# Altium schematic sheet dub synth.SchDoc: Dub Siren
size A3; Date: 3/2/2018; Author: Francisco J Fernández; DrawnBy: Francisco J Fernández; Address1: C\ Cristo de la Yedra nº 18, 3; Address4: 18012 - Granada - España; Project: Dub Siren; WebAddress: www.sevensols.com; ProjectName: Dub Siren
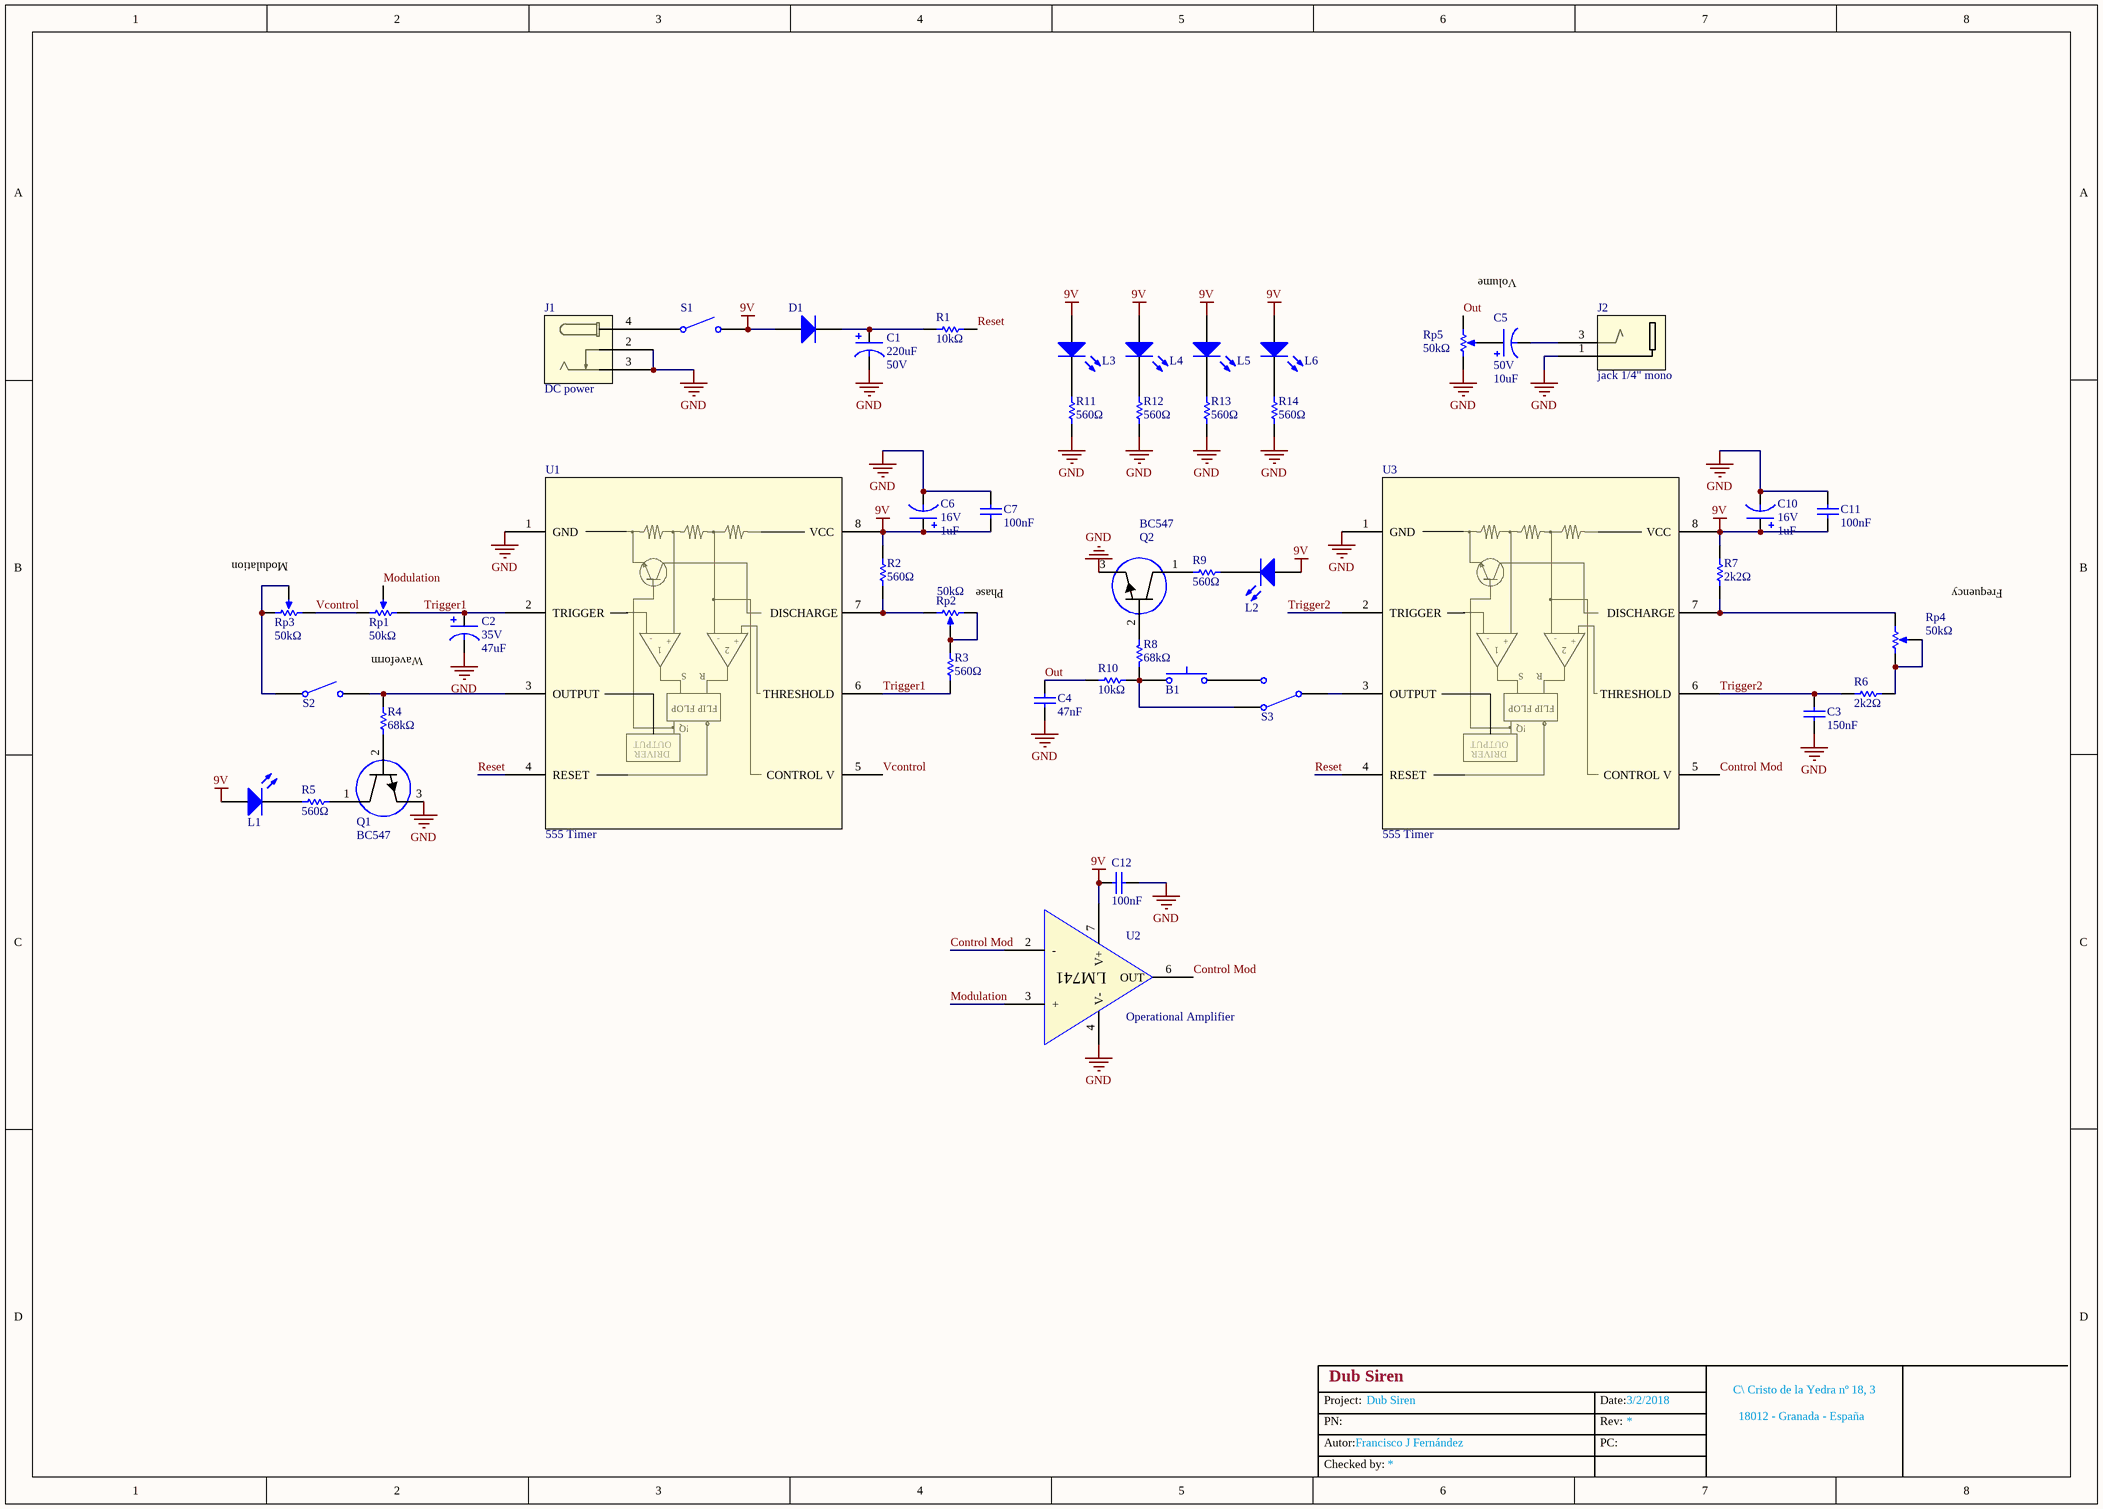
[diagram p0: dub synth.SchDoc]

## Parts
B1  SPST Momentary  [SPSTM]  (value not drawn)
C1  Capacitance: 220uF  Voltage rating: 50V  [AXIAL 0.5 - CAP ELECT]  (hidden comment: Capacitor Electrolitic)
C2  Voltage rating: 35V  Capacitance: 47uF  [Axial 0.26 - Cap Elect]  (hidden comment: Capacitor Electrolitic)
C3  value 150nF  [Axial 5 - Cap Ceramic]  (hidden comment: Capacitor)
C4  value 47nF  [Axial 5 - Cap Lentil]  (hidden comment: Capacitor)
C5  Voltage rating: 50V  Capacitance: 10uF  [Axial 0.26 - Cap Elect]  (hidden comment: Capacitor Electrolitic)
C6  Voltage rating: 16V  Capacitance: 1uF  [Axial 0.26 - Cap Elect]  (hidden comment: Capacitor Electrolitic)
C7  value 100nF  [Axial 5 - Cap Lentil]  (hidden comment: Capacitor)
C10  Voltage rating: 16V  Capacitance: 1uF  [Axial 0.26 - Cap Elect]  (hidden comment: Capacitor Electrolitic)
C11  value 100nF  [Axial 5 - Cap Lentil]  (hidden comment: Capacitor)
C12  value 100nF  [Axial 5 - Cap Lentil]  (hidden comment: Capacitor)
D1  Diode  [AXIAL - 0.76 DIODE]  (value not drawn)
J1  DC power  [DC Power]
J2  jack 1/4" mono  [jack 1/4" mono]
L1  LED  [Axial 0.26 - LED]  (value not drawn)
L2  LED  [Axial 0.26 - LED]  (value not drawn)
L3  LED  [Axial 0.26 - LED]  (value not drawn)
L4  LED  [Axial 0.26 - LED]  (value not drawn)
L5  LED  [Axial 0.26 - LED]  (value not drawn)
L6  LED  [Axial 0.26 - LED]  (value not drawn)
Q1  BC547  [TO-92B]
Q2  BC547  [TO-92B]
R1  Resistance: 10kΩ  [Axial - 1.0]  (hidden comment: Resistor)
R2  Resistance: 560Ω  [Axial - 1.0]  (hidden comment: Resistor)
R3  Resistance: 560Ω  [Axial - 1.0]  (hidden comment: Resistor)
R4  Resistance: 68kΩ  [Axial - 1.0]  (hidden comment: Resistor)
R5  Resistance: 560Ω  [Axial - 1.0]  (hidden comment: Resistor)
R6  Resistance: 2k2Ω  [Axial - 1.0]  (hidden comment: Resistor)
R7  Resistance: 2k2Ω  [Axial - 1.0]  (hidden comment: Resistor)
R8  Resistance: 68kΩ  [Axial - 1.0]  (hidden comment: Resistor)
R9  Resistance: 560Ω  [Axial - 1.0]  (hidden comment: Resistor)
R10  Resistance: 10kΩ  [Axial - 1.0]  (hidden comment: Resistor)
R11  Resistance: 560Ω  [Axial - 1.0]  (hidden comment: Resistor)
R12  Resistance: 560Ω  [Axial - 1.0]  (hidden comment: Resistor)
R13  Resistance: 560Ω  [Axial - 1.0]  (hidden comment: Resistor)
R14  Resistance: 560Ω  [Axial - 1.0]  (hidden comment: Resistor)
Rp1  Resistance: 50kΩ  [R0904N Thonk]  (hidden comment: RPot)
Rp2  Resistance: 50kΩ  [R0904N Thonk]  (hidden comment: RPot)
Rp3  Resistance: 50kΩ  [R0904N Thonk]  (hidden comment: RPot)
Rp4  Resistance: 50kΩ  [R0904N Thonk]  (hidden comment: RPot)
Rp5  Resistance: 50kΩ  [R0904N Thonk]  (hidden comment: RPot)
S1  SPST switch  [SPST]  (value not drawn)
S2  SPST switch  [SPST]  (value not drawn)
S3  SPDT Switch  [SPDT]  (value not drawn)
U1  555 Timer  [8 pins IC socket]
U2  Operational Amplifier  [8 pins IC socket]
U3  555 Timer  [8 pins IC socket]

## Nets
9V: C6.2 C7.2 C10.2 C11.2 C12.1 D1.1(A) L1.1(A) L2.1(A) L3.1(A) L4.1(A) L5.1(A) L6.1(A) R2.2 R7.2 S1.2 U1.8(VCC) U2.7(V+) U3.8(VCC)
GND: C1.1 C2.1 C3.1 C4.1 C6.1 C7.1 C10.1 C11.1 C12.2 J1.2 J1.3 J2.1 Q1.3(Emitter) Q2.3(Emitter) R11.1 R12.1 R13.1 R14.1 Rp5.1(TOP) U1.1(GND) U3.1(GND)
Control Mod: U2.2(-) U2.6(OUT) U3.5(CONTROL_V)
Modulation: Rp1.2(TAP) U2.3(+)
Out: C4.2 R10.1 Rp5.3(BOT)
Reset: R1.2 U1.4(RESET) U3.4(RESET)
Trigger1: C2.2 R3.1 Rp1.1(TOP) U1.2(TRIGGER) U1.6(THRESHOLD)
Trigger2: C3.2 R6.2 U3.2(TRIGGER) U3.6(THRESHOLD)
Vcontrol: Rp1.3(BOT) Rp3.1(TOP) U1.5(CONTROL_V)
NetB1_1: B1.1 R8.1 R10.2 S3.2
NetB1_2: B1.2 S3.3
NetC1_2: C1.2 D1.2(K) R1.1
NetC5_1: C5.1 J2.3
NetC5_2: C5.2 Rp5.2(TAP)
NetJ1_4: J1.4 S1.1
NetL1_2: L1.2(K) R5.1
NetL2_2: L2.2(K) R9.1
NetL3_2: L3.2(K) R11.2
NetL4_2: L4.2(K) R12.2
NetL5_2: L5.2(K) R13.2
NetL6_2: L6.2(K) R14.2
NetQ1_1: Q1.1(Collector) R5.2
NetQ1_2: Q1.2(Base) R4.1
NetQ2_1: Q2.1(Collector) R9.2
NetQ2_2: Q2.2(Base) R8.2
NetR2_1: R2.1 Rp2.1(TOP) U1.7(DISCHARGE)
NetR3_2: R3.2 Rp2.2(TAP) Rp2.3(BOT)
NetR4_2: R4.2 S2.2 U1.3(OUTPUT)
NetR6_1: R6.1 Rp4.1(TOP) Rp4.2(TAP)
NetR7_1: R7.1 Rp4.3(BOT) U3.7(DISCHARGE)
NetRp3_2: Rp3.2(TAP) Rp3.3(BOT) S2.1
NetS3_1: S3.1 U3.3(OUTPUT)

Not connected (* = marked no-connect by the designer): U2 4(V-)

## Notes on the sheet
- Volume
- (near Rp3) Modulation
- (near Rp2) Phase
- (near Rp4) Frequency
- Waveform
- Labels drawn without touching a wire or pin: GND
- Autor:
- Project:
- PN:
- Rev:
- Date:
- PC:
- Checked by:
- (in symbol 555) -; +; S; R; FLIP FLOP; !Q; DRIVER

## Library data of the parts
B1 = SPSTM: Push-to-make, SPST Momentary
C1 C2 C5 C6 C10 = Capacitor Electrolitic: Aluminum Capacitor Electrolitic
D1 = 1N4001: 1.0A rectifier
J1 = DC power: Jack DC 2.1mm, 3 contactos
J2 = jack 1/4" mono: Conectores de audio 1/4"JACK MTL NUT INSERT W/GRIP PTS
L1-L6 = LED: General purpose LED
Q1 Q2 = Transistor: Standart transistor
Rp1-Rp5 = RPot: Potentiometer; Sim Note: Enter the Resistance value and the set point into parameter fields.; Set Position: 0.5; Published: 8-Jun-2000; LatestRevisionDate: 17-Jul-2002; LatestRevisionNote: Re-released for DXP Platform.; PackageReference: VR5; Publisher: Altium Limited; PackageDescription: Variable Resistor, Thru-Hole; 3 Leads
S1 S2 = SPST: Single Pole, Single Throw
S3 = SPDT: Single Pole, Double Throw
U1 U3 = 555: Accurate time delays or oscillation generator; Package: PDIP8 + Socket
U2 = LM741: General purpose operational amplifier
C3 C4 C7 C11 C12 = Capacitor: Published: 8-Jun-2000; LatestRevisionDate: 29-May-2009; LatestRevisionNote: IPC-7351 Footprint Added.; PackageReference: C0805; Publisher: Altium Limited; PackageDescription: Chip Capacitor